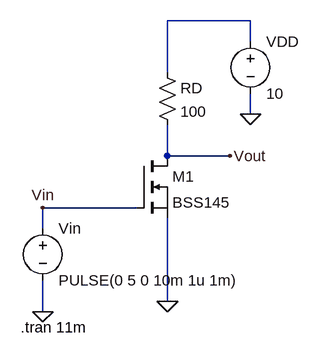
[diagram p0: schematic lab5.1b.asc]
lab5.1b.asc, the LTspice schematic file:
Version 4
SHEET 1 880 680
WIRE 304 16 176 16
WIRE 304 48 304 16
WIRE 176 96 176 16
WIRE 304 160 304 128
WIRE 176 224 176 176
WIRE 272 224 176 224
WIRE 128 304 -16 304
WIRE -16 336 -16 304
WIRE 176 448 176 320
WIRE -16 464 -16 416
FLAG 304 160 0
FLAG 272 224 Vout
FLAG 176 448 0
FLAG -16 464 0
FLAG -16 304 Vin
SYMBOL voltage 304 32 R0
WINDOW 123 0 0 Left 0
WINDOW 39 0 0 Left 0
SYMATTR InstName VDD
SYMATTR Value 10
SYMBOL res 160 80 R0
SYMATTR InstName RD
SYMATTR Value 100
SYMBOL nmos 128 224 R0
SYMATTR InstName M1
SYMATTR Value BSS145
SYMBOL voltage -16 320 R0
WINDOW 123 0 0 Left 0
WINDOW 39 0 0 Left 0
SYMATTR InstName Vin
SYMATTR Value PULSE(0 5 0 10m 1u 1m)
TEXT -50 488 Left 2 !.tran 11m

The netlist it stands for:
* lab5.1b.asc
VDD N001 0 10
RD N001 Vout 100
M1 Vout Vin 0 0 BSS145
Vin Vin 0 PULSE(0 5 0 10m 1u 1m)
.model NMOS NMOS
.model PMOS PMOS
.lib standard.mos
.tran 11m
.backanno
.end